# Altium schematic sheet PROCESSORv31.SchDoc: AMF CONTROLLER GC12 v3.0
size A4; Date: MAR 2013; DrawnBy: SURAJ K A; Engineer: SURAJ K A; Revision: 310; SheetNumber: 1; SheetTotal: 2; DocumentName: AMFR
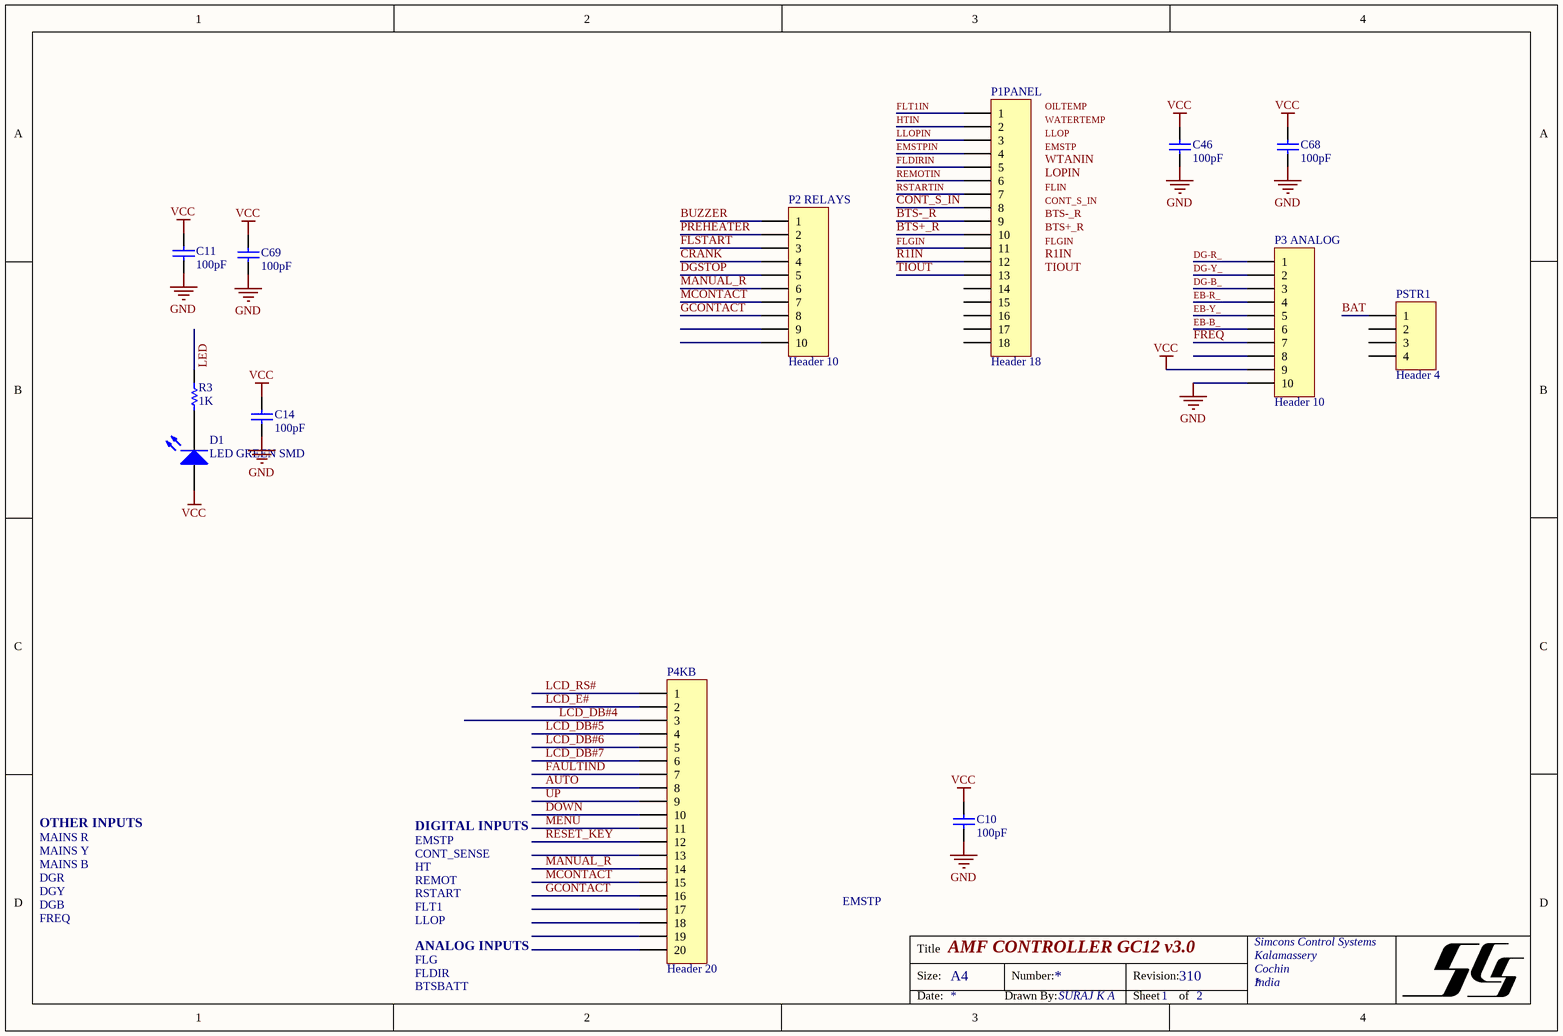
[diagram p0: PROCESSORv31.SchDoc]

## Parts
C10  value 100pF  [C1206_W]  (hidden comment: .1uF 1206)
C11  value 100pF  [C1206_W]  (hidden comment: 1uF 1206)
C14  value 100pF  [C1206_W]  (hidden comment: .1uF 1206)
C46  value 100pF  [C1206_W]  (hidden comment: .1uF 1206)
C68  value 100pF  [Cap_.1]  (hidden comment: 100uF/25V)
C69  value 100pF  [C1206_W]  (hidden comment: .1uF 1206)
D1  LED GREEN SMD  [LED SMD]
P1PANEL  Header 18  [HDR1X18_BURGE_F]
P2_RELAYS  Header 10  [HDR1X10_BURGE_F]
P3_ANALOG  Header 10  [HDR1X10_BURGE_F]
P4KB  Header 20  [HDR1X20_BURGE_F]
PSTR1  Header 4  [HDR1X4_BURGE_F]
R3  value 1K  [R1206_W]  (hidden comment: 1K 1206)

## Nets
GND: C10.1 C11.1 C14.1 C46.1 C68.2 C69.1 P3_ANALOG.10
VCC: C10.2 C11.2 C14.2 C46.2 C68.1 C69.2 D1.1(A) P3_ANALOG.9
AUTO: P4KB.8
BAT: PSTR1.1
BTS+_R: P1PANEL.10
BTS-_R: P1PANEL.9
BUZZER: P2_RELAYS.1
CONT_S_IN: P1PANEL.8
CRANK: P2_RELAYS.4
DG-B_: P3_ANALOG.3
DG-R_: P3_ANALOG.1
DG-Y_: P3_ANALOG.2
DGSTOP: P2_RELAYS.5
DOWN: P4KB.10
EB-B_: P3_ANALOG.6
EB-R_: P3_ANALOG.4
EB-Y_: P3_ANALOG.5
EMSTPIN: P1PANEL.4
FAULTIND: P4KB.7
FLDIRIN: P1PANEL.5
FLGIN: P1PANEL.11
FLSTART: P2_RELAYS.3
FLT1IN: P1PANEL.1
FREQ: P3_ANALOG.7
GCONTACT: P2_RELAYS.8 P4KB.16
HTIN: P1PANEL.2
LCD_DB#4: P4KB.3
LCD_DB#5: P4KB.4
LCD_DB#6: P4KB.5
LCD_DB#7: P4KB.6
LCD_E#: P4KB.2
LCD_RS#: P4KB.1
LED: R3.2
LLOPIN: P1PANEL.3
MANUAL_R: P2_RELAYS.6 P4KB.14
MCONTACT: P2_RELAYS.7 P4KB.15
MENU: P4KB.11
PREHEATER: P2_RELAYS.2
R1IN: P1PANEL.12
REMOTIN: P1PANEL.6
RESET_KEY: P4KB.12
RSTARTIN: P1PANEL.7
TIOUT: P1PANEL.13
UP: P4KB.9
NetD1_2: D1.2(K) R3.1

Not connected (* = marked no-connect by the designer): P1PANEL 14 15 16 17 18; P2_RELAYS 9 10; P3_ANALOG 8; P4KB 13 17 18 19 20; PSTR1 2 3 4

## Notes on the sheet
- OTHER INPUTS
- MAINS R
- MAINS Y
- DIGITAL INPUTS
- EMSTP
- CONT_SENSE
- MAINS B
- DGR
- DGY
- DGB
- FREQ
- HT
- REMOT
- RSTART
- FLT1
- LLOP
- ANALOG INPUTS
- FLG
- FLDIR
- BTSBATT
- Labels drawn without touching a wire or pin: BTS+_R, BTS-_R, CONT_S_IN, EMSTP, FLGIN, FLIN, LLOP, LOPIN, OILTEMP, R1IN, TIOUT, WATERTEMP, WTANIN
- Title
- Size:
- A4
- Number:
- Revision:
- Simcons Control Systems
- Kalamassery
- Cochin
- India
- Date:
- Drawn By:
- SURAJ K A
- Sheet
- of

## Library data of the parts
C10 C11 C14 C46 C68 C69 = Cap: Capacitor; Published: 8-Jun-2000; LatestRevisionDate: 17-Jul-2002; LatestRevisionNote: Re-released for DXP Platform.; PackageReference: RAD-0.3; Publisher: Altium Limited; PackageDescription: Radial Cap, Thru-Hole; 2 Leads; 0.3 in Pin Spacing
D1 = LED1: Typical RED GaAs LED; Published: 8-Jun-2000; LatestRevisionDate: 08-Jul-2005; LatestRevisionNote: Mech Layer 1 removed.; PackageReference: LED-1; Publisher: Altium Limited; PackageDescription: LED; 2 Leads
P1PANEL = Header 18: Header, 18-Pin; LatestRevisionDate: 17-Jul-2002; LatestRevisionNote: Re-released for DXP Platform.; Publisher: Altium Limited
P2_RELAYS P3_ANALOG = Header 10: Header, 10-Pin; LatestRevisionDate: 17-Jul-2002; LatestRevisionNote: Re-released for DXP Platform.; Publisher: Altium Limited
P4KB = Header 20: Header, 20-Pin; LatestRevisionDate: 17-Jul-2002; LatestRevisionNote: Re-released for DXP Platform.; Publisher: Altium Limited
PSTR1 = Header 4: Header, 4-Pin; LatestRevisionDate: 17-Jul-2002; LatestRevisionNote: Re-released for DXP Platform.; Publisher: Altium Limited
R3 = Res1: Resistor; Published: 8-Jun-2000; LatestRevisionDate: 17-Jul-2002; LatestRevisionNote: Re-released for DXP Platform.; PackageReference: AXIAL-0.3; Publisher: Altium Limited; PackageDescription: Axial Device, Thru-Hole; 2 Leads; 0.3 in Pin Spacing